# EAGLE design MOBHUINO (EAGLE 6.4)
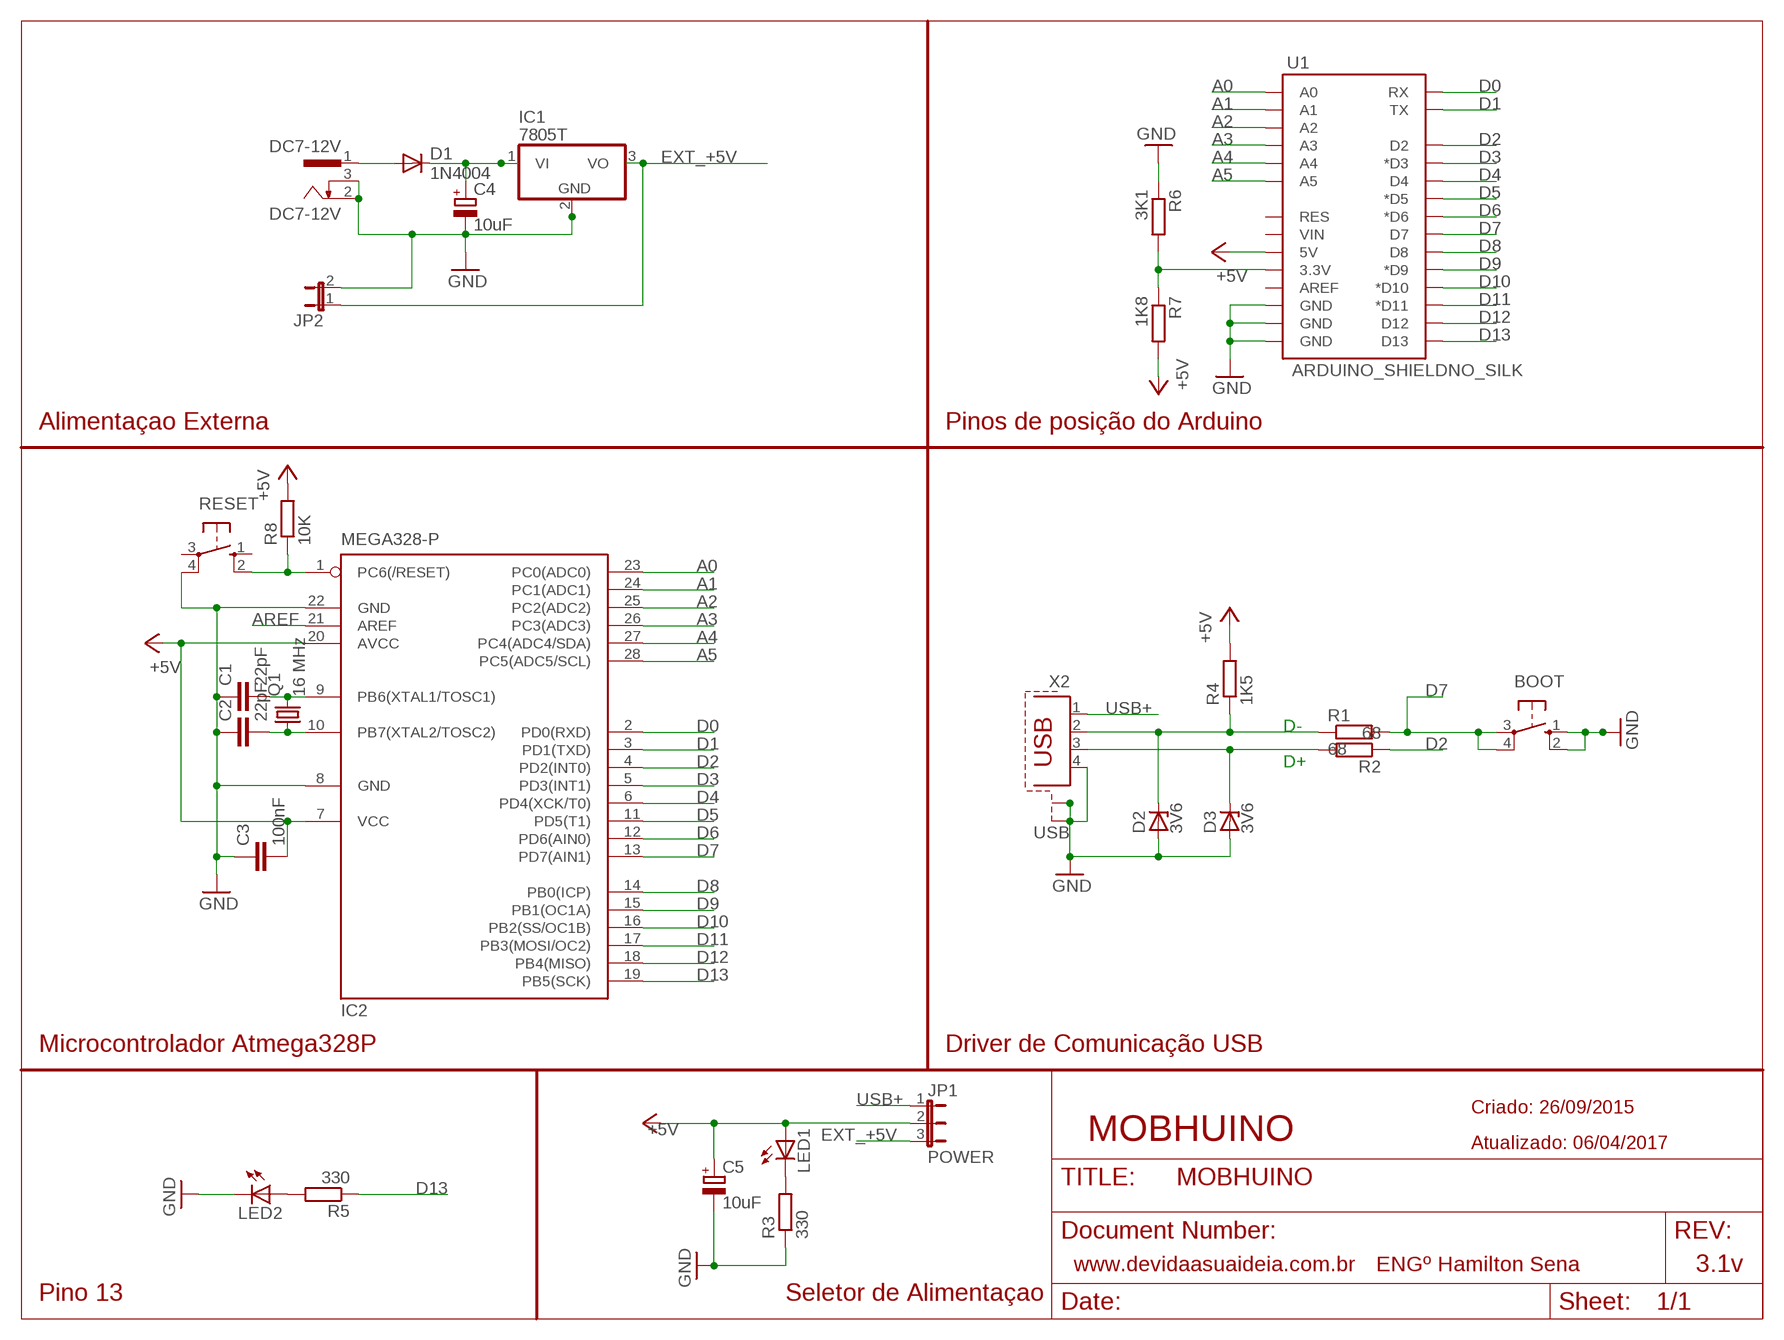
[diagram p0: schematic, sheet 1]

## Parts
BOOT  10-XX  [B3F-10XX]
C1  22pF  C-EU025-024X044  [C025-024X044]
C2  22pF  C-EU025-024X044  [C025-024X044]
C3  100nF  C-EU050-024X044  [C050-024X044]
C4  10uF  CPOL-EUE2.5-6  [E2,5-6]
C5  10uF  CPOL-EUE2.5-6  [E2,5-6]
D1  1N4004  [DO41-10]
D2  3V6  ZENER-DIODEDO34-7  [DO34Z7]
D3  3V6  ZENER-DIODEDO34-7  [DO34Z7]
DC7-12V  DC7-12V  733980-62  [733980-62]
IC1  7805T  [TO220H]
IC2  MEGA328-P  MEGA8-P  [DIL28-3]
JP1  POWER  JP2E  [JP2]
JP2  JP1E  [JP1]
LED1  LED3MM  [LED3MM]
LED2  LED3MM  [LED3MM]
Q1  16 MHz  CRYSTALHC49S  [HC49/S]
R1  68  R-EU_0207/7  [0207/7]
R2  68  R-EU_0207/7  [0207/7]
R3  330  R-EU_0207/7  [0207/7]
R4  1K5  R-EU_0207/7  [0207/7]
R5  330  R-EU_0207/7  [0207/7]
R6  3K1  R-EU_0207/7  [0207/7]
R7  1K8  R-EU_0207/7  [0207/7]
R8  10K  R-EU_0207/7  [0207/7]
RESET  10-XX  [B3F-10XX]
U1  ARDUINO_SHIELDNO_SILK  [DUEMILANOVE_VIAS]
X2  USB  PN61729-S  [PN61729-S]

## Nets
+5V: C3.2 C5.+ IC2.7(VCC) IC2.20(AVCC) JP1.2 LED1.A R4.2 R7.2 R8.2 U1.5V
A0: IC2.23(PC0(ADC0)) U1.A0
A1: IC2.24(PC1(ADC1)) U1.A1
A2: IC2.25(PC2(ADC2)) U1.A2
A3: IC2.26(PC3(ADC3)) U1.A3
A4: IC2.27(PC4(ADC4/SDA)) U1.A4
A5: IC2.28(PC5(ADC5/SCL)) U1.A5
AREF: IC2.21(AREF)
D0: IC2.2(PD0(RXD)) U1.RX
D1: IC2.3(PD1(TXD)) U1.TX
D2: IC2.4(PD2(INT0)) R2.1 U1.D2
D3: IC2.5(PD3(INT1)) U1.D3(*D3)
D4: IC2.6(PD4(XCK/T0)) U1.D4
D5: IC2.11(PD5(T1)) U1.D5(*D5)
D6: IC2.12(PD6(AIN0)) U1.D6(*D6)
D7: BOOT.3(P) BOOT.4(P1) IC2.13(PD7(AIN1)) R1.2 U1.D7
D8: IC2.14(PB0(ICP)) U1.D8
D9: IC2.15(PB1(OC1A)) U1.D9(*D9)
D10: IC2.16(PB2(SS/OC1B)) U1.D10(*D10)
D11: IC2.17(PB3(MOSI/OC2)) U1.D11(*D11)
D12: IC2.18(PB4(MISO)) U1.D12
D13: IC2.19(PB5(SCK)) R5.1 U1.D13
D-: D2.C R1.1 R4.1 X2.2
EXT_+5V: IC1.3(VO) JP1.3 JP2.1
GND: BOOT.1(S) BOOT.2(S1) C1.1 C2.1 C3.1 C4.- C5.- D2.A D3.A DC7-12V.2 DC7-12V.3 IC1.2(GND) IC2.8(GND) IC2.22(GND) JP2.2 LED2.K(C) R3.1 R6.1 RESET.4(P1) U1.GND@0(GND) U1.GND@1(GND) U1.GND@2(GND) X2.4 X2.S1 X2.S2
N$3: D1.A DC7-12V.1
N$4: R6.2 R7.1 U1.3.3V
N$21: C1.2 IC2.9(PB6(XTAL1/TOSC1)) Q1.2
N$22: C2.2 IC2.10(PB7(XTAL2/TOSC2)) Q1.1
N$23: IC2.1(PC6(/RESET)) R8.1 RESET.2(S1)
N$26: LED2.A R5.2
N$30: D3.C R2.2 X2.3
N$31: LED1.K(C) R3.2
N$32: C4.+ D1.C IC1.1(VI)
USB+: JP1.1 X2.1
Unconnected: RESET.1(S) RESET.3(P) U1.AREF U1.RES U1.VIN

## Notes on the sheet
- Alimentaçao Externa | Pinos de posição do Arduino
- D-
- D+
- Microcontrolador Atmega328P | Driver de Comunicação USB
- Criado: 26/09/2015
- MOBHUINO
- Atualizado: 06/04/2017
- www.devidaasuaideia.com.br | ENGº Hamilton Sena | 3.1v
- Pino 13 | Seletor de Alimentaçao

## Library data of the parts
BOOT RESET = switch-omron:10-XX: OMRON SWITCH; MPN: B3F-1000; OC_FARNELL: 176432; OC_NEWARK: 36M3542
C1-C3 = rcl:C-EU: CAPACITOR, European symbol
C4 C5 = rcl:CPOL-EU: POLARIZED CAPACITOR, European symbol
D1 = diode:1N4004: DIODE general purpose rectifier, 1 A
D2 D3 = diode:ZENER-DIODE: Z-Diode
DC7-12V = con-conrad:73398?: FEMALE PRINT CONNECTOR Niedervolt-Steckverbinder Distributor Conrad
IC1 = linear:78*: Positive VOLTAGE REGULATOR Source: http://cache.national.com/ds/LM/LM78L05.pdf http://www.fairchildsemi.com/ds/LM/LM7805.pdf
IC2 = atmel:MEGA8-P: MICROCONTROLLER 8 Kbytes FLASH, 1 kbytes SRAM, 512 bytes EEPROM, USART, 4-channel 10 bit ADC, 2-channel 8 bit ADC Pin compatible with Atmega48, ATMega88, ATMega168 Source: avr.lbr; OC_FARNELL: unknown; OC_NEWARK: unknown
JP1 = jumper:JP2E: JUMPER
JP2 = jumper:JP1E: JUMPER
LED1 LED2 = led:LED: LED OSRAM: - CHIPLED LG R971, LG N971, LY N971, LG Q971, LY Q971, LO R971, LY R971 LH N974, LH R974 LS Q976, LO Q976, LY Q976 LO Q996 - Hyper CHIPLED LW Q18S LB Q993, LB Q99A, LB R99A - SideLED LS A670, LO A670, LY A670, LG A670, LP A670 LB A673, LV A673, LT A673, LW A673 LH A674 LY A675 LS A676, LA A676, LO A676, LY A676, LW A676 LS A679, LY A679, LG A679 - Hyper Micro SIDELED® LS Y876, LA Y876, LO Y876, LY Y876 LT Y87S - SmartLED LW L88C, LW L88S LB L89C, LB L89S, LG L890 LS L89K, LO L89K, LY L89K LS L896, LA L896, LO L896, LY L896 - TOPLED LS T670, LO T670, LY T670, LG T670, LP T670 LSG T670, LSP T670, LSY T670, LOP T670, LYG T670 LG T671, LOG T671, LSG T671 LB T673, LV T673, LT T673, LW T673 LH T674 LS T676, LA T676, LO T676, LY T676, LB T676, LH T676, LSB T676, LW T676 LB T67C, LV T67C, LT T67C, LS T67K, LO T67K, LY T67K, LW E67C LS E67B, LA E67B, LO E67B, LY E67B, LB E67C, LV E67C, LT E67C LW T67C LS T679, LY T679, LG T679 LS T770, LO T770, LY T770, LG T770, LP T770 LB T773, LV T773, LT T773, LW T773 LH T774 LS E675, LA E675, LY E675, LS T675 LS T776, LA T776, LO T776, LY T776, LB T776 LHGB T686 LT T68C, LB T68C - Hyper Mini TOPLED® LB M676 - Mini TOPLED Santana® LG M470 LS M47K, LO M47K, LY M47K Source: http://www.osram.convergy.de LUXEON: - LUMILED® LXK2-PW12-R00, LXK2-PW12-S00, LXK2-PW14-U00, LXK2-PW14-V00 LXK2-PM12-R00, LXK2-PM12-S00, LXK2-PM14-U00 LXK2-PE12-Q00, LXK2-PE12-R00, LXK2-PE12-S00, LXK2-PE14-T00, LXK2-PE14-U00 LXK2-PB12-K00, LXK2-PB12-L00, LXK2-PB12-M00, LXK2-PB14-N00, LXK2-PB14-P00, LXK2-PB14-Q00 LXK2-PR12-L00, LXK2-PR12-M00, LXK2-PR14-Q00, LXK2-PR14-R00 LXK2-PD12-Q00, LXK2-PD12-R00, LXK2-PD12-S00 LXK2-PH12-R00, LXK2-PH12-S00 LXK2-PL12-P00, LXK2-PL12-Q00, LXK2-PL12-R00 Source: www.luxeon.com KINGBRIGHT: KA-3528ASYC Source: www.kingbright.com
Q1 = crystal:CRYSTAL: CRYSTAL; OC_FARNELL: 1667008; OC_NEWARK: unknown
R1-R8 = rcl:R-EU_: RESISTOR, European symbol
U1 = SparkFun-Boards:ARDUINO_SHIELD: Arduino shield footprint
X2 = con-berg:PN61729-S: BERG USB connector; OC_FARNELL: unknown; OC_NEWARK: unknown

## Board
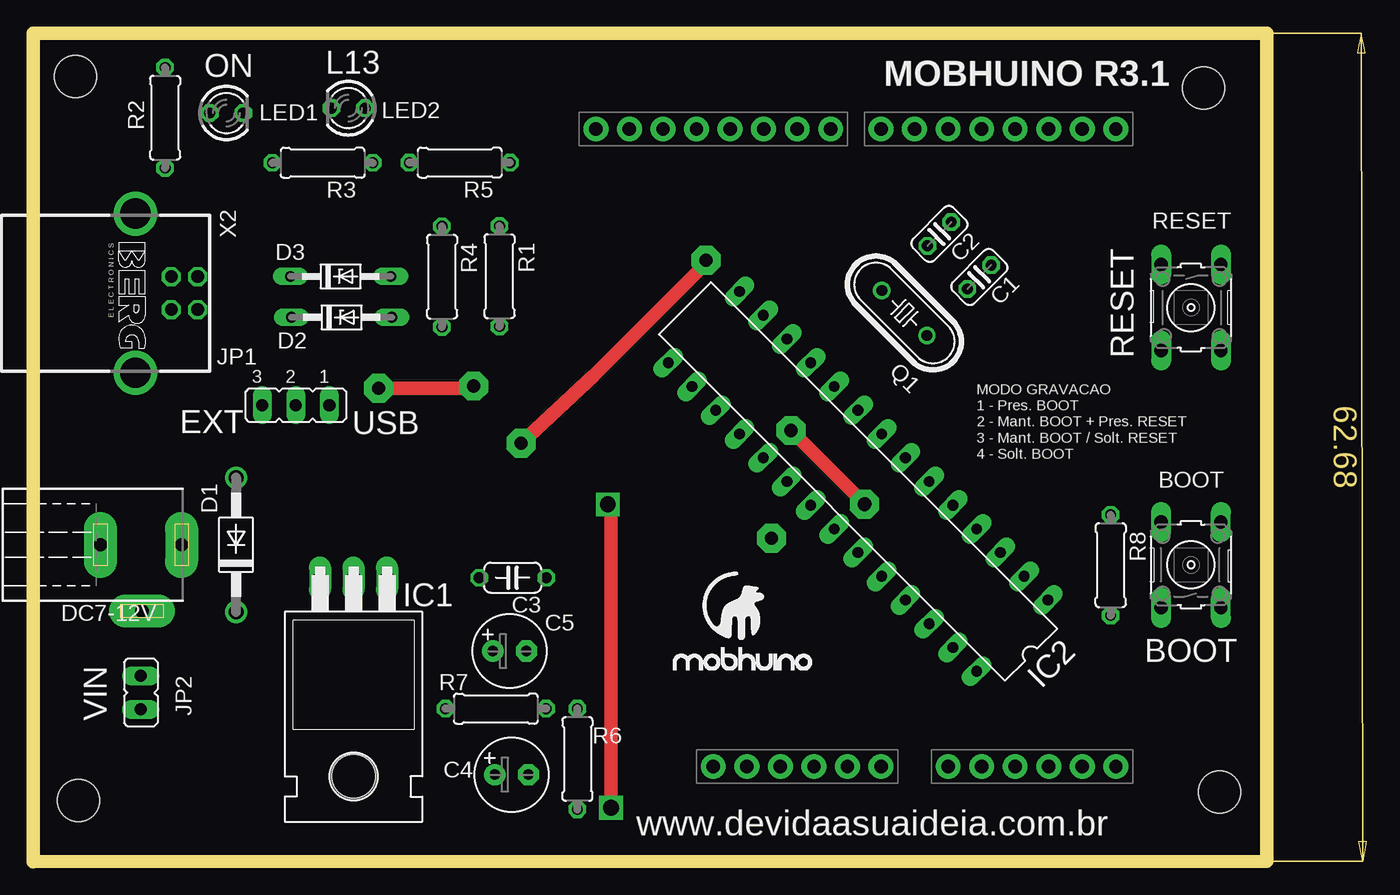
[diagram p1: board, top side]
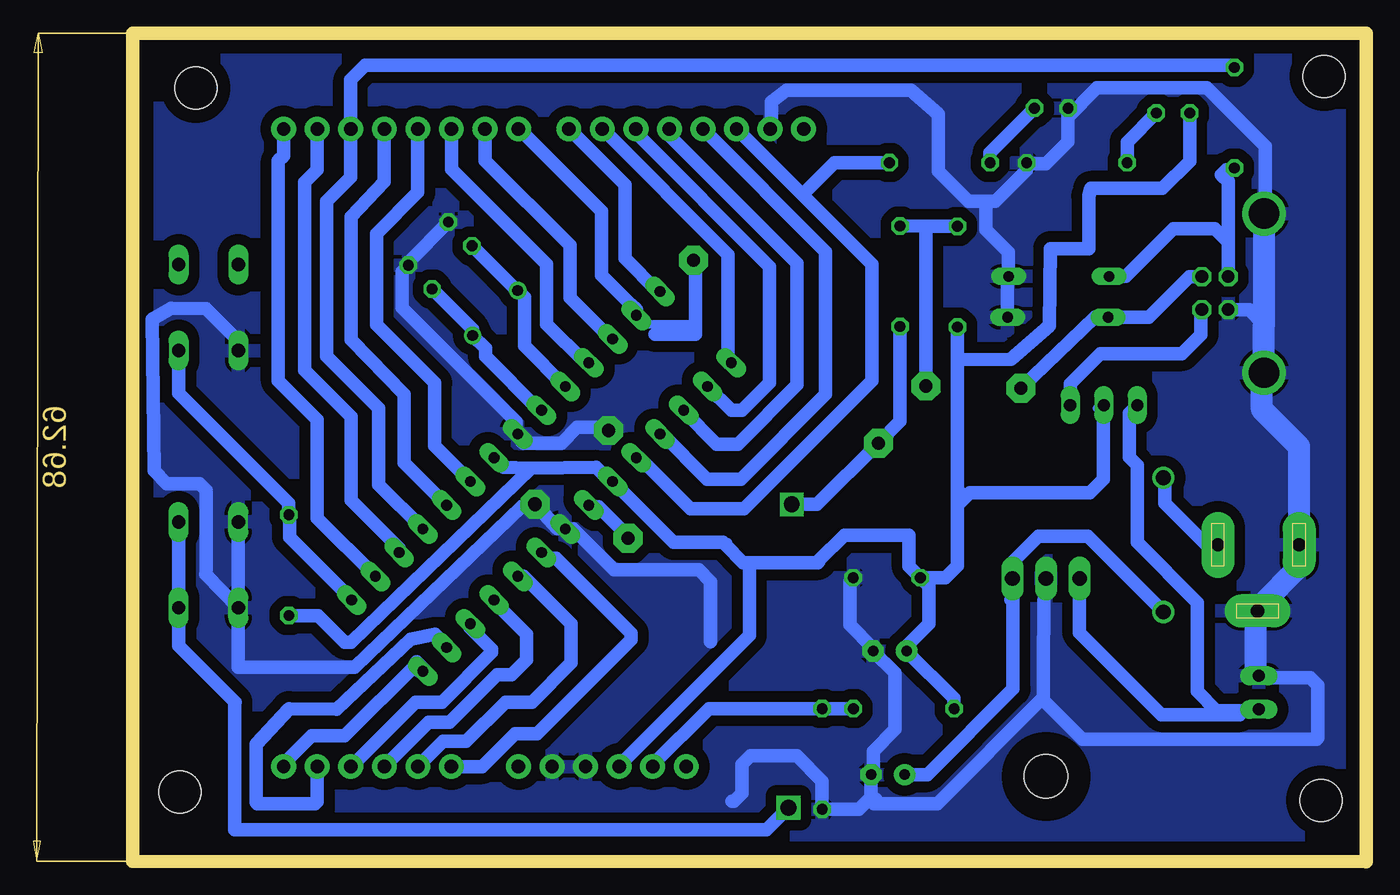
[diagram p2: board, bottom side, seen from below]

Size 93.43 x 62.71 mm. Coordinates in mm from the lower left corner, seen from the top.
Outline: 0.03,0 93.42,0.03 93.43,62.71 0,62.71 0.03,0
Copper layers (1*16): Top 0.035mm / dielectric 1.5mm / Bottom 0.035mm
Design rules "default *": minimum track width 25mil, minimum drill 24mil, track to track 12mil, track to pad 12mil, pad to pad 12mil, via to via 12mil, smd to smd 8mil, copper to edge 40mil, drill to drill 8mil, minimum pad ring 10mil, minimum via ring 8mil, stop-mask expansion 4mil, vias tented up to drill 0mil, thermal gap 10mil
Holes 3.2 mm at 89.84,5.28 88.64,58.56 3.44,4.64 3.2,59.44

### Footprints (pad centres in the part's own frame; a part is rotated, then mirrored left to right if it is on the bottom)
B3F-10XX = drill 1.016 long: 1 -3.251,2.261; 2 3.251,2.261; 3 -3.251,-2.261; 4 3.251,-2.261
C025-024X044 = drill 0.813 octagon: 1 -1.27,0; 2 1.27,0
C050-024X044 = drill 0.813 octagon: 1 -2.54,0; 2 2.54,0
E2,5-6 = drill 0.813 pad 1.6: + -1.27,0 | drill 0.813 pad 1.6 octagon: - 1.27,0
DO41-10 = drill 1.118: A 5.08,0; C -5.08,0
DO34Z7 = drill 0.813 long: A 3.81,0; C -3.81,0
733980-62 = drill 1 pad 2.5 long: 1 0,8.57; 2 0,2.42; 3 5,5.57
TO220H = drill 1.118 long: 1 -2.54,-10.16; 2 0,-10.16; 3 2.54,-10.16 | hole 3.302: 0,4.826
DIL28-3 = drill 0.813 long: 1 -16.51,-3.81; 2 -13.97,-3.81; 3 -11.43,-3.81; 4 -8.89,-3.81; 5 -6.35,-3.81; 6 -3.81,-3.81; 7 -1.27,-3.81; 8 1.27,-3.81; 9 3.81,-3.81; 10 6.35,-3.81; 11 8.89,-3.81; 12 11.43,-3.81; 13 13.97,-3.81; 14 16.51,-3.81; 15 16.51,3.81; 16 13.97,3.81; 17 11.43,3.81; 18 8.89,3.81; 19 6.35,3.81; 20 3.81,3.81; 21 1.27,3.81; 22 -1.27,3.81; 23 -3.81,3.81; 24 -6.35,3.81; 25 -8.89,3.81; 26 -11.43,3.81; 27 -13.97,3.81; 28 -16.51,3.81
JP2 = drill 0.914 long: 1 -2.54,0; 2 0,0; 3 2.54,0
JP1 = drill 0.914 long: 1 0,-1.27; 2 0,1.27
LED3MM = drill 0.813 octagon: A -1.27,0; K 1.27,0
HC49/S = drill 0.813: 1 -2.413,0; 2 2.413,0
0207/7 = drill 0.813 octagon: 1 -3.81,0; 2 3.81,0
DUEMILANOVE_VIAS = drill 1.016 pad 1.88: 3.3V 50.8,13.97; 5V 50.8,16.51; A0 50.8,29.21; A1 50.8,31.75; A2 50.8,34.29; A3 50.8,36.83; A4 50.8,39.37; A5 50.8,41.91; AREF 2.54,2.54; D2 2.54,36.83; D3 2.54,34.29; D4 2.54,31.75; D5 2.54,29.21; D6 2.54,26.67; D7 2.54,24.13; D8 2.54,20.32; D9 2.54,17.78; D10 2.54,15.24; D11 2.54,12.7; D12 2.54,10.16; D13 2.54,7.62; GND@0 50.8,19.05; GND@1 50.8,21.59; GND@2 2.54,5.08; RES 50.8,11.43; RX 2.54,41.91; TX 2.54,39.37; VIN 50.8,24.13
PN61729-S = drill 0.95 octagon: 1 1.25,4.71; 2 -1.25,4.71; 3 -1.25,2.71; 4 1.25,2.71 | drill 2.3 pad 2.9: S1 -6.02,0; S2 6.02,0

### Placement (x,y rotation side)
BOOT  87.68,22.47 90 top
C1  71.65,44.25 225 top
C2  68.63,47.51 225 top
C3  36.32,21.49 180 top
C4  36.24,6.59 0 top
C5  36.09,15.94 0 top
D1  15.38,23.98 90 top
D2  23.37,41.2 0 top
D3  23.29,44.3 0 top
DC7-12V  2.68,23.98 270 top
IC1  24.27,11.28 180 top
IC2  62.47,28.78 135 top
JP1  19.9,34.56 180 top
JP2  8.16,12.8 0 top
LED1  14.65,56.67 0 top
LED2  23.87,57.03 180 top
Q1  65.98,41.53 315 top
R1  35.32,44.31 270 top
R2  10,56.31 270 top
R3  21.93,52.9 180 top
R4  30.97,44.28 270 top
R5  32.31,52.91 180 top
R6  41.22,7.77 90 top
R7  35.04,11.58 180 top
R8  81.6,22.44 270 top
RESET  87.68,41.94 270 top
U1  40.08,58 270 top
X2  7.76,43.03 270 top

### Tracks (layer width: path | path; a pad name or v marks a point on that pad's centre or on a via)
+5V
  Bottom 0.635: JP1.2 20.41,34.32 19.92,34.32 | 48.35,24.16 48.54,23.98 | C5.+ 34.38,16.54 34.48,16.64 | 57.48,29 57.24,29.24 IC2.20
  Bottom 1.016: 34.82,16.3 34.48,16.64 33.12,18 33.12,20.83 C3.2 | U1.5V 56.48,7.2 56.48,7.36 46.72,17.12 46.72,22.56 46.8,22.64 | C3.2 31.87,21.49 30.98,22.38 30.98,26.97 | 19.92,34.54 19.92,34.32 19.92,28.96 20.96,27.92 30.03,27.92 30.98,26.97 | 30.98,38 26.92,38.01 24,40.56 23.92,46.4 21.04,46.4 21.04,50.4 20.88,50.96 15.44,50.96 13.38,53.02 LED1.A | 46.8,22.64 47.2,22.64 48.54,23.98 48.72,24.16 52.46,24.16 IC2.20 | C3.2 34.64,22.35 34.64,24.72 39.52,24.72 41.44,22.8 41.44,22.72 41.52,22.64 46.8,22.64 | 57.26,28.78 57.48,29 58.32,29.84 63.27,29.78 | 63.27,29.78 65.33,29.84 IC2.7 | R7.2 31.23,12.35 C5.+ | R4.2 30.97,38.02 30.98,38 | R8.2 79.38,18.63 77.37,16.62 76.88,16.62 63.27,29.78 | 30.98,38 30.98,28.14 | 30.98,28.14 30.98,26.97 | 30.76,27.92 30.98,28.14
A0
  Bottom 1.016: U1.A0 66.96,7.2 64.48,9.68 62.8,9.68 55.68,16.8 55.68,17.28 61.36,22.96 62.04,22.96 IC2.23
A1
  Bottom 0.635: 63.14,21.17 IC2.24
  Bottom 1.016: U1.A1 69.91,9.12 68.16,9.12 65.2,12.08 63.2,12.08 60.24,15.04 60.24,18 63.84,21.6 IC2.24
A2
  Bottom 1.016: IC2.25 66.06,19.66 63.6,17.2 63.6,15.28 64.72,14.16 65.84,14.16 69.44,10.56 71.01,10.56 U1.A2
A3
  Bottom 0.635: U1.A3 76.88,7.2
  Bottom 1.016: 76.88,7.2 72,12.08 70,12.08 66.24,15.84 66.24,16.08 67.86,17.7 IC2.26
A4
  Bottom 0.635: 69.97,16.63 IC2.27
  Bottom 1.016: 69.97,16.63 70.54,17.2 72.38,16.84 77.97,11.55 81.59,11.58 84.08,8.88 84.08,4.48 84,4.4 79.6,4.4 79.45,4.55 U1.A4
A5
  Bottom 0.635: 71.84,14.28 IC2.28 | 82.18,7.23 U1.A5
  Bottom 1.016: 82.18,7.23 79.89,9.52 77.36,9.52 71.92,14.96 71.92,15.12 71.45,14.65 IC2.28
D0
  Bottom 1.016: U1.RX 81.99,53.45 82.4,53.04 82.4,36.4 79.44,33.44 79.44,25.99 IC2.2
D1
  Bottom 0.635: 73.25,23.68 73.25,23.73
  Bottom 1.016: 73.25,23.73 76.88,27.36 76.88,33.68 80.4,37.2 80.4,51.44 79.45,52.39 U1.TX | 73.25,23.68 IC2.3
D2
  Bottom 1.016: IC2.4 74.8,28.54 74.8,34.32 78.72,38.24 78.72,50 76.91,51.81 U1.D2 76.91,59.17 75.81,60.27 10.15,60.27 R2.1
D3
  Bottom 1.016: IC2.5 72.88,30.21 72.88,35.36 76.88,39.52 76.88,48.8 74.37,51.47 U1.D3
D4
  Bottom 1.016: IC2.6 70.56,31.48 70.56,36.24 74.96,40.64 74.96,47.52 71.83,50.65 U1.D4
D5
  Bottom 1.016: U1.D5 69.29,52.41 62.08,45.2 62.08,40.7 59.15,37.76 IC2.11
D6
  Bottom 0.635: 66.67,55.16 U1.D6
  Bottom 1.016: U1.D6 66.75,53.07 60.32,46.64 60.32,42.69 57.28,39.65 57.18,39.65 IC2.12
D7  (via drill 1 pad 2.18, 1.2)
  Top 1.016: v50.96,45.52 50.96,45.28 42.48,36.8 v36.96,31.68 | v43.76,4.07 43.76,26.8 v43.52,27.04
  Bottom 0.635: 63.86,55.16 U1.D7 | 55.72,42.2 55.97,41.94 IC2.13 54.7,40.67 50.8,40.67
  Bottom 1.016: 63.86,55.16 57.92,49.22 57.92,44.4 55.72,42.2 55.29,41.77 | 53.85,39.92 50.8,39.92 50.8,40.67 50.8,45.36 v50.96,45.52 | R1.2 35.32,33.32 v36.96,31.68 41.6,27.04 v43.52,27.04 | 44.17,3.66 v43.76,4.07 45.43,2.4 85.7,2.4 85.7,12.06 85.68,12.08 89.94,16.34 BOOT.3 BOOT.4
D8
  Bottom 1.016: IC2.14 53.63,43.15 56.16,45.68 56.16,51.22 U1.D8
D9
  Bottom 0.635: 48.35,37.77 IC2.15
  Bottom 1.016: 48.35,37.77 48.35,45.95 U1.D9
D10
  Bottom 1.016: IC2.16 48.09,34.16 47.28,34.16 45.2,36.24 45.2,45.04 55.32,55.16 U1.D10
D11
  Bottom 1.016: IC2.17 51.69,34.09 49.2,31.6 47.6,31.6 43.12,36.08 43.12,45.28 52.78,54.94 U1.D11
D12
  Bottom 1.016: IC2.18 53.33,32.37 49.92,28.96 47.36,28.96 40.96,35.36 40.96,46.18 U1.D12
D13
  Bottom 1.016: IC2.19 55.06,30.58 51.2,26.72 47.12,26.72 37.44,36.4 37.44,45.2 42.72,50.48 | 42.72,50.48 U1.D13 | R5.1 40.29,52.91 42.72,50.48
D-  (via drill 1 pad 2.18)
  Top 1.016: v26.16,35.84 33.2,35.84 v33.36,36
  Bottom 1.016: v26.16,35.84 20.56,41.2 D2.C 16.48,41.2 13.4,44.28 X2.2 | R1.1 33.61,48.09 | 33.61,48.09 R4.1 | v33.36,36 33.36,47.96 33.61,48.09
EXT_+5V
  Bottom 1.016: 9.28,11.44 11.36,11.44 12.8,12.88 12.8,19.6 17.36,24.16 17.36,29.99 17.97,30.6 17.97,33.95 JP1.3 | 9.28,11.44 8.25,11.44 JP2.1 | IC1.3 21.73,17.33 15.52,11.12 9.6,11.12 9.28,11.44
GND  (via drill 1, 1 pad 2.18)
  Top 0.61: v62.97,27.1 v62.96,27.04
  Top 1.016: v57.4,32.64 v62.97,27.1
  Bottom 0.635: 37.54,15.69 C5.- | 24.38,21.33 IC1.2 | 8.41,14.28 JP2.2 7.94,13.81 7,13.81 | 8.41,18.98 DC7-12V.3 7.94,19.45 | 5.12,22.27 5.12,23.68 DC7-12V.2 | 45.06,55.63 U1.GND@2 | 64.33,32.6 IC2.8
  Bottom 1.016: 24.38,21.33 24.46,15.74 24.46,12.42 24.56,12.32 | C2.1 72.55,45.39 C1.1 73.04,44.66 73.04,41.92 64.4,33.28 64.4,32.56 64.48,32.48 64.37,32.48 IC2.8 64.27,32.27 63.92,31.92 63.92,31.76 63.84,31.68 60.96,31.68 59.76,32.88 57.64,32.88 v57.4,32.64 | v62.96,27.04 63.95,26.9 76.63,14.73 85.42,14.73 BOOT.1 | v62.97,27.1 61.27,25.19 IC2.22 60.07,25.19 56.96,22.08 50.56,22.08 49.68,21.2 49.68,16.65 | LED2.K 22.6,56.36 | 25.74,52.34 28.08,50 28.88,50 | 28.88,50 30.16,50 32.4,52.24 32.4,56.56 34.48,58.4 43.92,58.4 45.04,57.52 45.04,55.58 U1.GND@2 | D2.A 27.18,44.22 D3.A 27.1,46.14 28.8,47.84 28.8,49.92 28.88,50 | C3.1 39.12,21.23 39.12,17.92 37.36,16.16 C5.- 35.7,14.28 35.7,10.02 37.35,8.37 37.35,6.75 C4.- 37.51,5.04 37.43,4.96 | 22.6,56.36 20.4,58.56 12.08,58.56 7.68,54.16 7.68,49.13 X2.S1 | 24.56,12.32 32.49,4.39 37.28,4.39 37.07,4.6 37.43,4.96 | JP2.2 8.01,13.92 4.24,13.92 3.68,13.36 3.68,9.36 3.76,9.28 21.52,9.28 24.56,12.32 | 85.42,39.42 87.84,41.84 90.5,41.87 91.93,41.07 91.81,29.57 90.83,28.59 88.35,28.59 87.87,28.11 87.87,21.74 87.88,21.74 BOOT.1 | 7.92,36.85 X2.S2 | 7.76,40.64 7.88,40.76 | 7.88,40.76 8.88,41.76 10.45,41.76 X2.4 | 7.76,40.88 7.88,40.76 | BOOT.2 BOOT.1 | 22.6,56.36 22.6,54.5 24.27,52.83 25.67,52.83 R3.1 | 37.43,4.96 38.43,3.96 R6.1 41.22,6.09 43.14,8.01 46.65,8.01 47.28,7.38 47.28,5.19 47.88,4.59 48.06,4.59
  Bottom 1.676: 8.41,18.98 8.41,14.28 | 7.94,19.45 5.12,22.27 | DC7-12V.2 5.1,31.42 7.92,34.24 7.92,36.85 | X2.S2 7.76,40.64 | X2.S1 7.76,40.88
  pour Bottom (isolate 0.813): 1.83,61.44 91.5,61.44 91.5,1.95 1.86,1.95 1.86,61.41
N$1
  Bottom 1.016: 58.8,26.88 58.16,26.88 55.84,24.56
N$2  (via drill 1 pad 2.18)
  other vias: 55.92,24.48
N$3
  Bottom 1.016: DC7-12V.1 12.14,23.98 15.28,27.12 15.28,28.96 D1.A
N$4
  Bottom 1.016: U1.3.3V 54.05,7.33 49.8,11.58 R6.2 R7.1
N$21
  Bottom 1.016: IC2.9 62.65,34.17 66.72,38.24 66.72,38.86 Q1.2 67.69,40.29 C1.2
N$22
  Bottom 1.016: IC2.10 60.68,35.96 63.76,39.04 63.76,42.72 Q1.1 64.36,43.24 C2.2
N$23
  Bottom 1.016: RESET.2 89.94,35.46 81.6,27.12 R8.1 81.54,26.19 81.54,24.57 76.84,19.87 IC2.1
N$26
  Bottom 1.016: R5.2 28.5,53.67 LED2.A
N$30
  Bottom 1.016: X2.3 10.48,46.89 | R2.2 10.12,52.38 10.62,52.38 10.99,52.01 10.48,51.49 10.48,46.89 | D3.C 18.22,44.3 14.61,47.91 11.5,47.91 10.48,46.89
N$31
  Bottom 1.016: R3.2 18.12,54.47 LED1.K
N$32
  Bottom 0.406: 26.88,19.86 26.76,19.86 26.76,20.79
  Bottom 0.635: 27.2,21.33 IC1.1 26.73,21.8
  Bottom 1.016: D1.C 21.09,24.62 24.85,24.62 26.73,22.73 26.73,21.52 IC1.1 | 26.91,19.83 26.88,19.86 | 26.88,21.37 IC1.1 | C4.+ 33.25,6.59 26.76,13.08 26.76,20.79 26.76,21.39 IC1.1
USB+
  Bottom 1.016: JP1.1 22.44,36.18 20.16,38.46 13.98,38.46 12.54,39.9 12.54,41.71 X2.1

### Text on the board
tPlace: L13 | ON | MOBHUINO R3.1 | RESET | EXT | USB | MODO GRAVACAO / 1 - Pres. BOOT / 2 - Mant. BOOT + Pres. RESET / 3 - Mant. BOOT / Solt. RESET / 4 - Solt. BOOT | BOOT | VIN | www.devidaasuaideia.com.br
tDocu: - | +